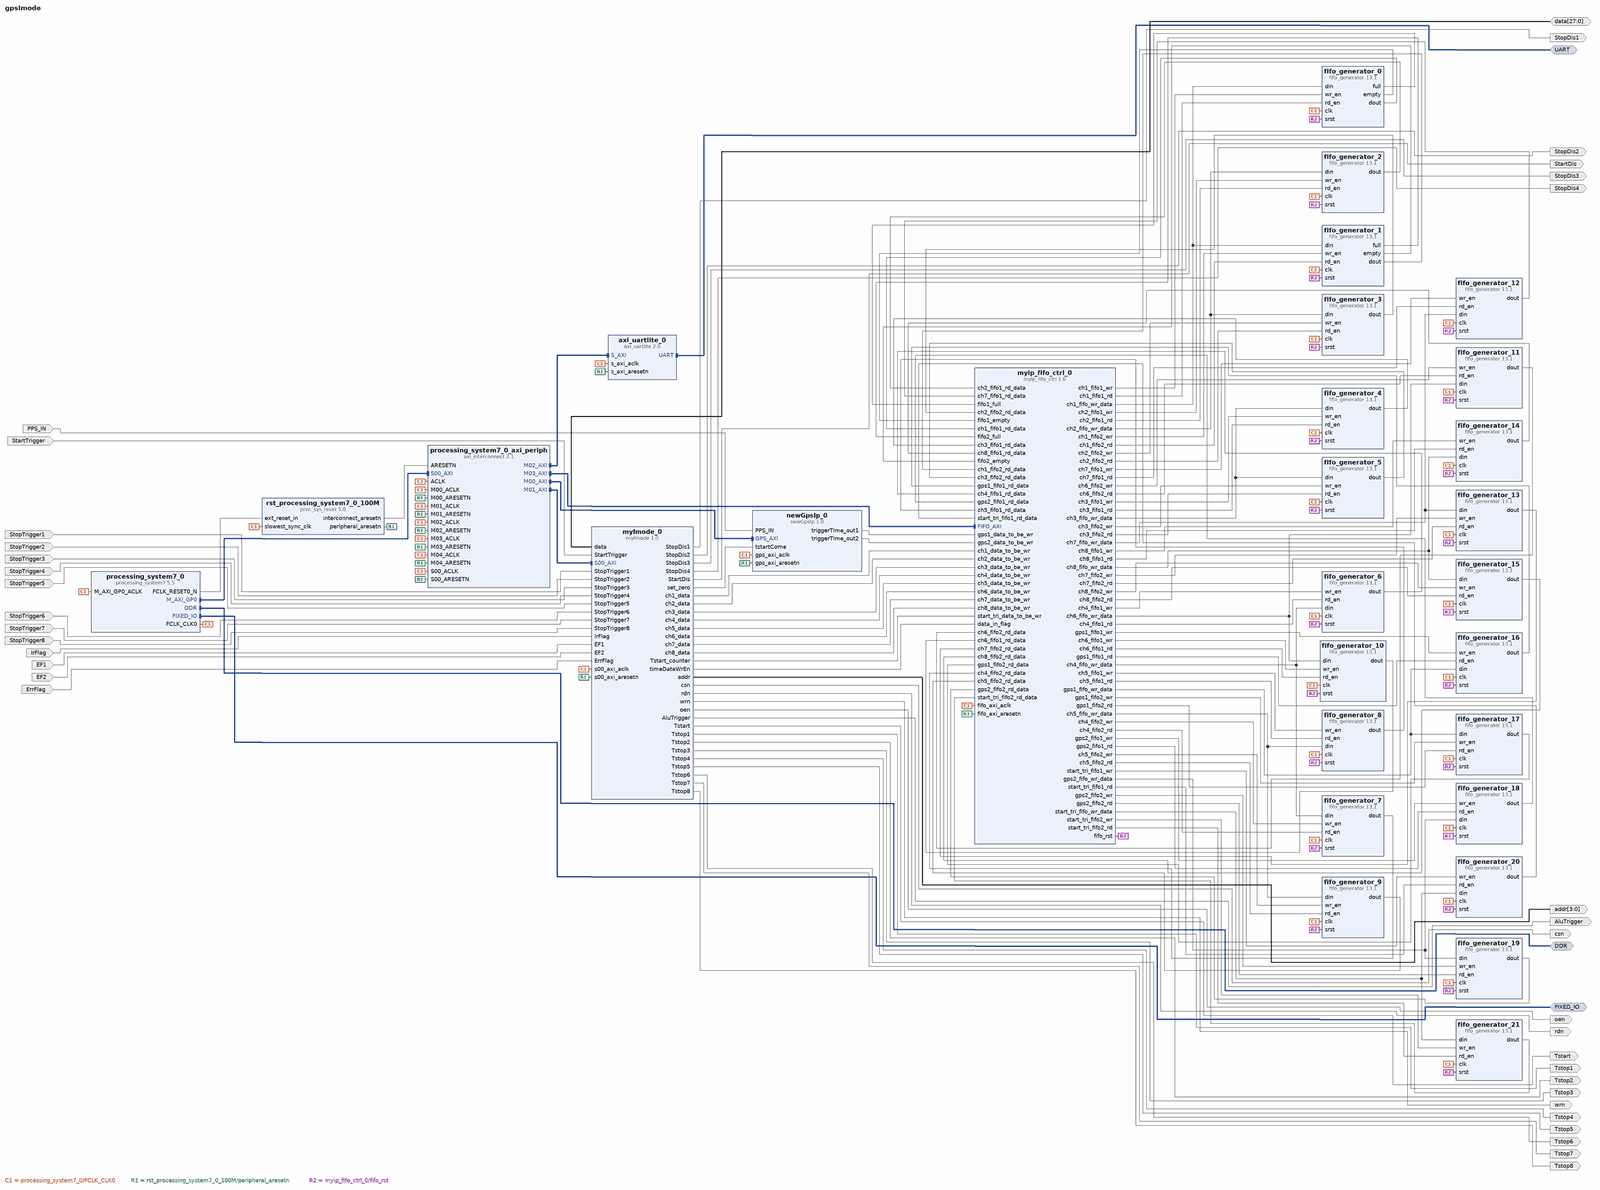
[diagram p0: block diagram of the top level, whole]
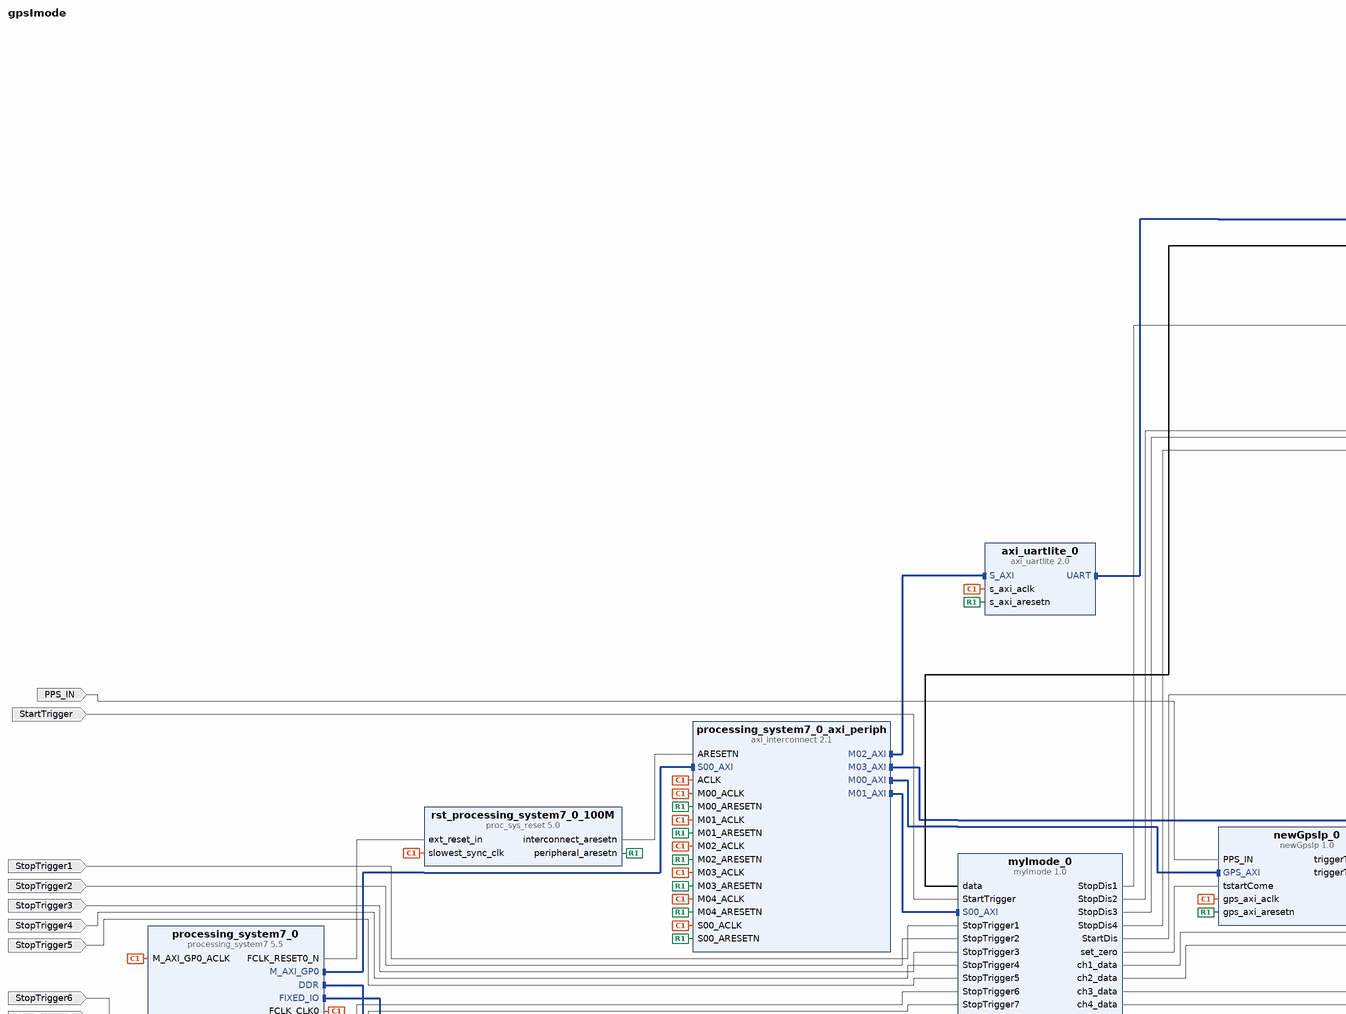
[diagram p1: block diagram of the top level, upper left part]
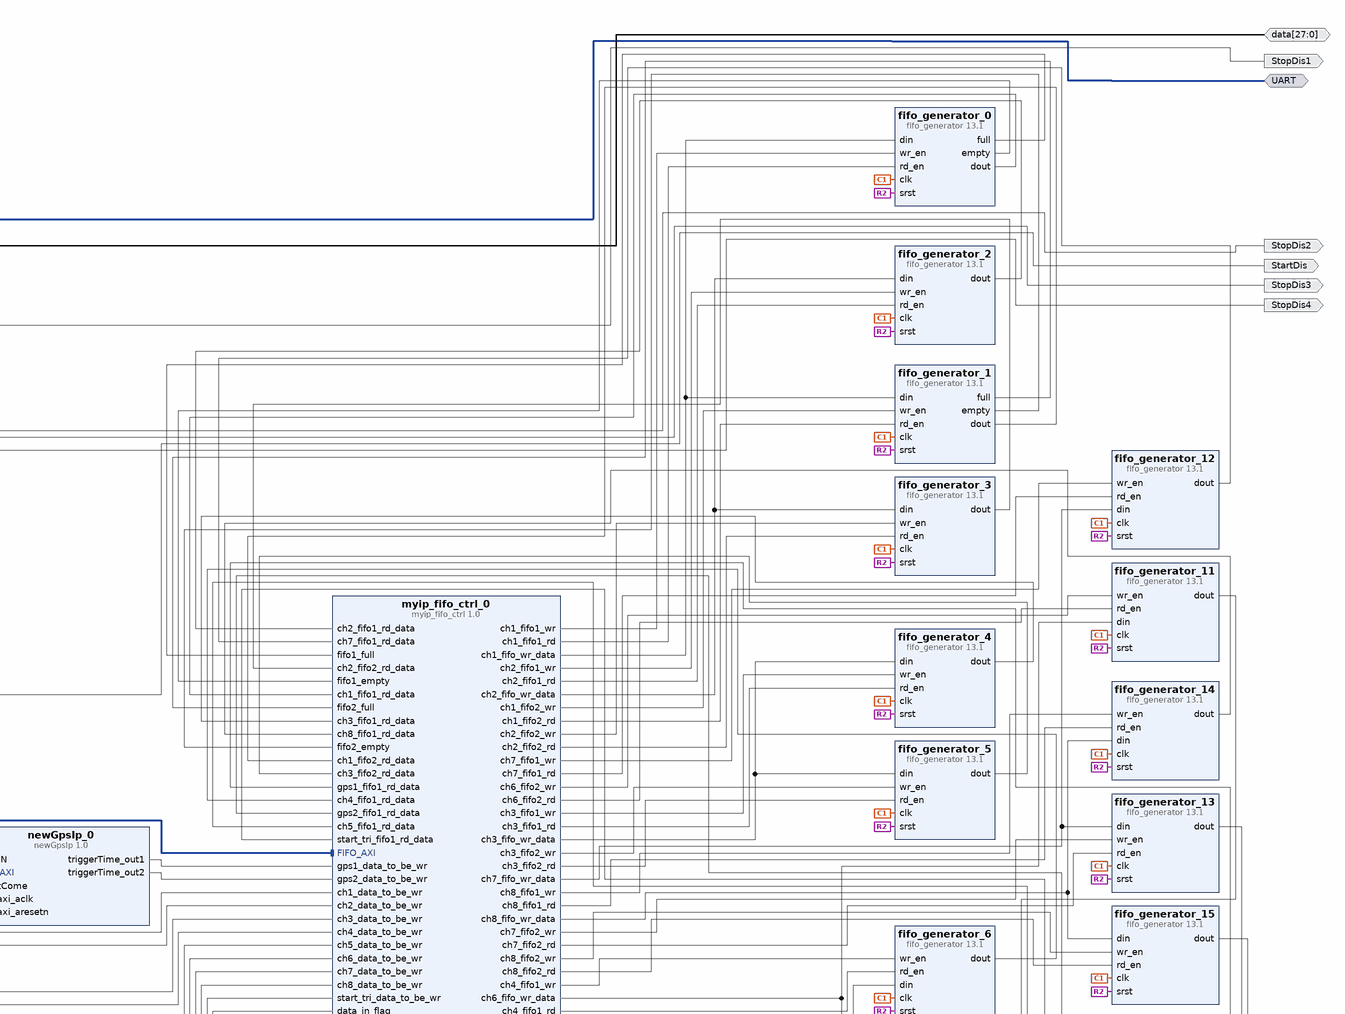
[diagram p2: block diagram of the top level, upper right part]
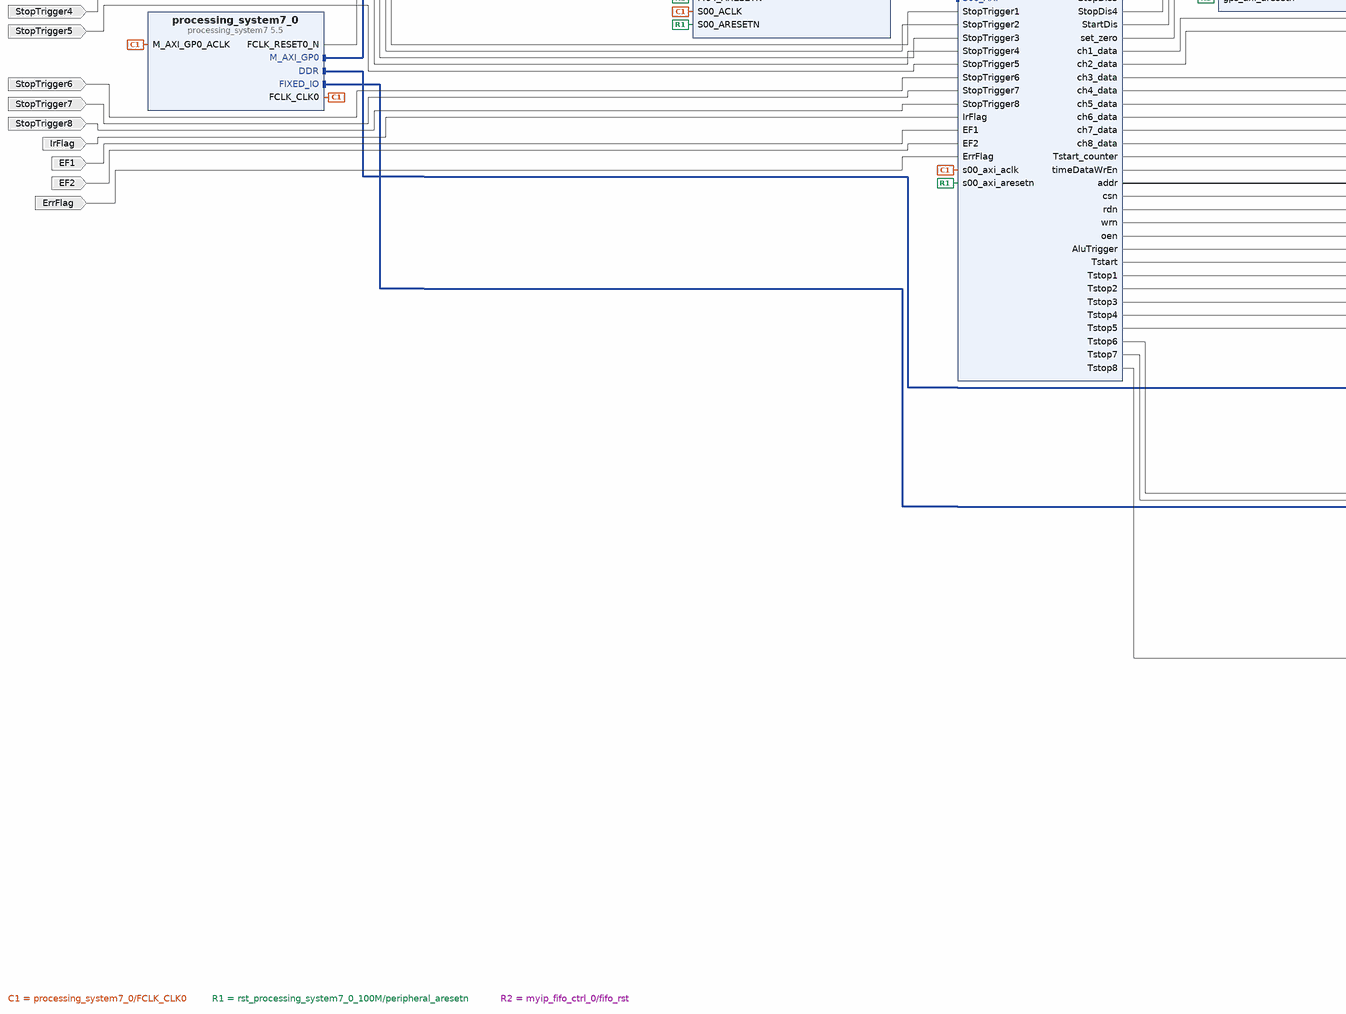
[diagram p3: block diagram of the top level, lower left part]
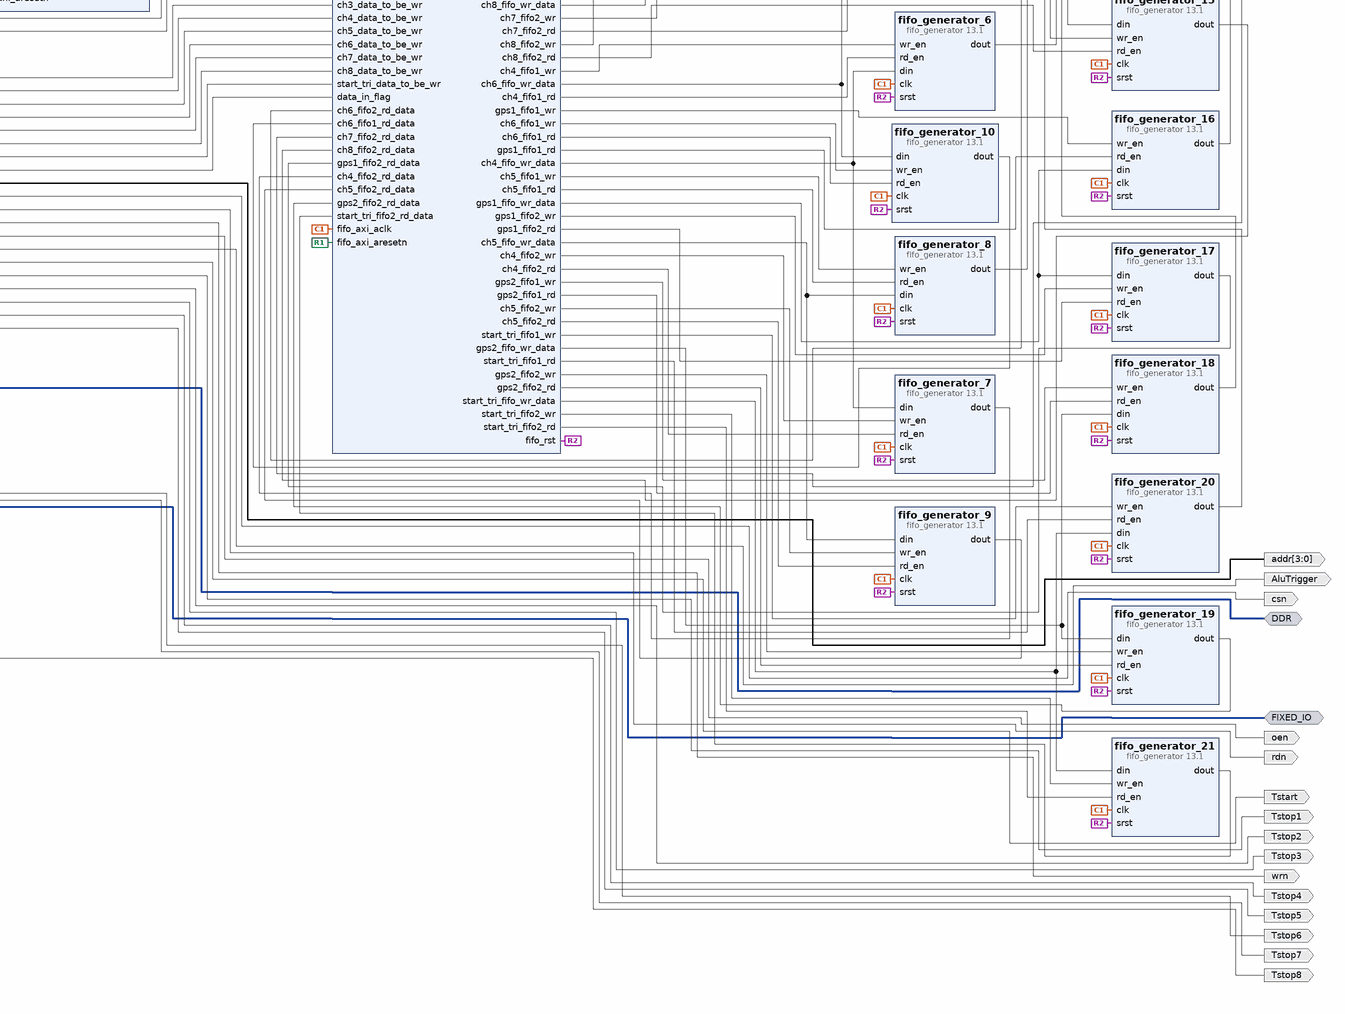
[diagram p4: block diagram of the top level, lower right part]
# Vivado block design gpsImode, Vivado 2016.2
create_bd_design gpsImode

create_bd_intf_port -mode Master -vlnv xilinx.com:interface:ddrx_rtl:1.0 DDR
create_bd_intf_port -mode Master -vlnv xilinx.com:display_processing_system7:fixedio_rtl:1.0 FIXED_IO
create_bd_intf_port -mode Master -vlnv xilinx.com:interface:uart_rtl:1.0 UART
create_bd_port -dir I PPS_IN
create_bd_port -dir I StartTrigger
create_bd_port -dir I StopTrigger1
create_bd_port -dir I StopTrigger2
create_bd_port -dir I StopTrigger3
create_bd_port -dir I StopTrigger4
create_bd_port -dir I StopTrigger5
create_bd_port -dir I StopTrigger6
create_bd_port -dir I StopTrigger7
create_bd_port -dir I StopTrigger8
create_bd_port -dir I IrFlag
create_bd_port -dir I EF1
create_bd_port -dir O StopDis1
create_bd_port -dir O StopDis2
create_bd_port -dir O StopDis3
create_bd_port -dir O StopDis4
create_bd_port -dir O StartDis
create_bd_port -dir O -from 3 -to 0 addr
create_bd_port -dir IO -from 27 -to 0 data
create_bd_port -dir O wrn
create_bd_port -dir O rdn
create_bd_port -dir O csn
create_bd_port -dir O oen
create_bd_port -dir O AluTrigger
create_bd_port -dir O Tstart
create_bd_port -dir O Tstop1
create_bd_port -dir O Tstop2
create_bd_port -dir O Tstop3
create_bd_port -dir O Tstop4
create_bd_port -dir O Tstop5
create_bd_port -dir O Tstop6
create_bd_port -dir O Tstop7
create_bd_port -dir O Tstop8
create_bd_port -dir I EF2
create_bd_port -dir I ErrFlag

create_bd_cell -type ip -vlnv xilinx.com:ip:processing_system7:5.5 processing_system7_0
set_property -dict [list \
  CONFIG.PCW_USE_FABRIC_INTERRUPT 1 \
  CONFIG.PCW_IRQ_F2P_INTR 1 \
  CONFIG.PCW_QSPI_GRP_SINGLE_SS_ENABLE 1 \
  CONFIG.preset ZedBoard \
] [get_bd_cells processing_system7_0]
create_bd_cell -type ip -vlnv xilinx.com:ip:axi_uartlite:2.0 axi_uartlite_0
create_bd_cell -type ip -vlnv xilinx.com:ip:axi_interconnect:2.1 processing_system7_0_axi_periph
set_property -dict {CONFIG.NUM_MI 5} [get_bd_cells processing_system7_0_axi_periph]
create_bd_cell -type ip -vlnv xilinx.com:ip:proc_sys_reset:5.0 rst_processing_system7_0_100M
create_bd_cell -type ip -vlnv xilinx.com:ip:fifo_generator:13.1 fifo_generator_0
set_property -dict [list \
  CONFIG.Input_Data_Width 17 \
  CONFIG.Input_Depth 8192 \
  CONFIG.Output_Data_Width 17 \
] [get_bd_cells fifo_generator_0]
create_bd_cell -type ip -vlnv xilinx.com:ip:fifo_generator:13.1 fifo_generator_1
set_property -dict [list \
  CONFIG.Input_Data_Width 17 \
  CONFIG.Input_Depth 8192 \
  CONFIG.Output_Data_Width 17 \
] [get_bd_cells fifo_generator_1]
create_bd_cell -type ip -vlnv xilinx.com:ip:fifo_generator:13.1 fifo_generator_2
set_property -dict [list \
  CONFIG.Input_Data_Width 17 \
  CONFIG.Input_Depth 8192 \
  CONFIG.Output_Data_Width 17 \
] [get_bd_cells fifo_generator_2]
create_bd_cell -type ip -vlnv xilinx.com:ip:fifo_generator:13.1 fifo_generator_3
set_property -dict [list \
  CONFIG.Input_Data_Width 17 \
  CONFIG.Input_Depth 8192 \
  CONFIG.Output_Data_Width 17 \
] [get_bd_cells fifo_generator_3]
create_bd_cell -type ip -vlnv xilinx.com:ip:fifo_generator:13.1 fifo_generator_4
set_property -dict [list \
  CONFIG.Input_Data_Width 17 \
  CONFIG.Input_Depth 8192 \
  CONFIG.Output_Data_Width 17 \
] [get_bd_cells fifo_generator_4]
create_bd_cell -type ip -vlnv xilinx.com:ip:fifo_generator:13.1 fifo_generator_5
set_property -dict [list \
  CONFIG.Input_Data_Width 17 \
  CONFIG.Input_Depth 8192 \
  CONFIG.Output_Data_Width 17 \
] [get_bd_cells fifo_generator_5]
create_bd_cell -type ip -vlnv xilinx.com:ip:fifo_generator:13.1 fifo_generator_6
set_property -dict [list \
  CONFIG.Input_Data_Width 17 \
  CONFIG.Input_Depth 8192 \
  CONFIG.Output_Data_Width 17 \
] [get_bd_cells fifo_generator_6]
create_bd_cell -type ip -vlnv xilinx.com:ip:fifo_generator:13.1 fifo_generator_7
set_property -dict [list \
  CONFIG.Input_Data_Width 17 \
  CONFIG.Input_Depth 8192 \
  CONFIG.Output_Data_Width 17 \
] [get_bd_cells fifo_generator_7]
create_bd_cell -type ip -vlnv xilinx.com:ip:fifo_generator:13.1 fifo_generator_8
set_property -dict [list \
  CONFIG.Input_Data_Width 17 \
  CONFIG.Input_Depth 8192 \
  CONFIG.Output_Data_Width 17 \
] [get_bd_cells fifo_generator_8]
create_bd_cell -type ip -vlnv xilinx.com:ip:fifo_generator:13.1 fifo_generator_9
set_property -dict [list \
  CONFIG.Input_Data_Width 17 \
  CONFIG.Input_Depth 8192 \
  CONFIG.Output_Data_Width 17 \
] [get_bd_cells fifo_generator_9]
create_bd_cell -type ip -vlnv xilinx.com:ip:fifo_generator:13.1 fifo_generator_10
set_property -dict [list \
  CONFIG.Input_Data_Width 17 \
  CONFIG.Input_Depth 8192 \
  CONFIG.Output_Data_Width 17 \
] [get_bd_cells fifo_generator_10]
create_bd_cell -type ip -vlnv xilinx.com:ip:fifo_generator:13.1 fifo_generator_11
set_property -dict [list \
  CONFIG.Input_Data_Width 17 \
  CONFIG.Input_Depth 8192 \
  CONFIG.Output_Data_Width 17 \
] [get_bd_cells fifo_generator_11]
create_bd_cell -type ip -vlnv xilinx.com:ip:fifo_generator:13.1 fifo_generator_12
set_property -dict [list \
  CONFIG.Input_Data_Width 17 \
  CONFIG.Input_Depth 8192 \
  CONFIG.Output_Data_Width 17 \
] [get_bd_cells fifo_generator_12]
create_bd_cell -type ip -vlnv xilinx.com:ip:fifo_generator:13.1 fifo_generator_13
set_property -dict [list \
  CONFIG.Input_Data_Width 17 \
  CONFIG.Input_Depth 8192 \
  CONFIG.Output_Data_Width 17 \
] [get_bd_cells fifo_generator_13]
create_bd_cell -type ip -vlnv xilinx.com:ip:fifo_generator:13.1 fifo_generator_14
set_property -dict [list \
  CONFIG.Input_Data_Width 17 \
  CONFIG.Input_Depth 8192 \
  CONFIG.Output_Data_Width 17 \
] [get_bd_cells fifo_generator_14]
create_bd_cell -type ip -vlnv xilinx.com:ip:fifo_generator:13.1 fifo_generator_15
set_property -dict [list \
  CONFIG.Input_Data_Width 17 \
  CONFIG.Input_Depth 8192 \
  CONFIG.Output_Data_Width 17 \
] [get_bd_cells fifo_generator_15]
create_bd_cell -type ip -vlnv xilinx.com:ip:fifo_generator:13.1 fifo_generator_16
set_property -dict [list \
  CONFIG.Input_Data_Width 32 \
  CONFIG.Input_Depth 8192 \
  CONFIG.Output_Data_Width 32 \
] [get_bd_cells fifo_generator_16]
create_bd_cell -type ip -vlnv xilinx.com:ip:fifo_generator:13.1 fifo_generator_17
set_property -dict [list \
  CONFIG.Input_Data_Width 32 \
  CONFIG.Input_Depth 8192 \
  CONFIG.Output_Data_Width 32 \
] [get_bd_cells fifo_generator_17]
create_bd_cell -type ip -vlnv xilinx.com:ip:fifo_generator:13.1 fifo_generator_18
set_property -dict [list \
  CONFIG.Input_Data_Width 32 \
  CONFIG.Input_Depth 8192 \
  CONFIG.Output_Data_Width 32 \
] [get_bd_cells fifo_generator_18]
create_bd_cell -type ip -vlnv xilinx.com:ip:fifo_generator:13.1 fifo_generator_19
set_property -dict [list \
  CONFIG.Input_Data_Width 32 \
  CONFIG.Input_Depth 8192 \
  CONFIG.Output_Data_Width 32 \
] [get_bd_cells fifo_generator_19]
create_bd_cell -type ip -vlnv xilinx.com:ip:fifo_generator:13.1 fifo_generator_20
set_property -dict [list \
  CONFIG.Input_Data_Width 32 \
  CONFIG.Input_Depth 8192 \
  CONFIG.Output_Data_Width 32 \
] [get_bd_cells fifo_generator_20]
create_bd_cell -type ip -vlnv xilinx.com:ip:fifo_generator:13.1 fifo_generator_21
set_property -dict [list \
  CONFIG.Input_Data_Width 32 \
  CONFIG.Input_Depth 8192 \
  CONFIG.Output_Data_Width 32 \
] [get_bd_cells fifo_generator_21]
create_bd_cell -type ip -vlnv xilinx.com:user:myip_fifo_ctrl:1.0 myip_fifo_ctrl_0
create_bd_cell -type ip -vlnv xilinx.com:user:myImode:1.0 myImode_0
create_bd_cell -type ip -vlnv xilinx.com:user:newGpsIp:1.0 newGpsIp_0

# ---- connections ----

connect_bd_intf_net [get_bd_intf_pins processing_system7_0/M_AXI_GP0] [get_bd_intf_pins processing_system7_0_axi_periph/S00_AXI]
connect_bd_intf_net [get_bd_intf_pins processing_system7_0_axi_periph/M00_AXI] [get_bd_intf_pins newGpsIp_0/GPS_AXI]
connect_bd_intf_net [get_bd_intf_pins processing_system7_0_axi_periph/M02_AXI] [get_bd_intf_pins axi_uartlite_0/S_AXI]
connect_bd_intf_net [get_bd_intf_pins processing_system7_0_axi_periph/M01_AXI] [get_bd_intf_pins myImode_0/S00_AXI]
connect_bd_intf_net [get_bd_intf_pins processing_system7_0_axi_periph/M03_AXI] [get_bd_intf_pins myip_fifo_ctrl_0/FIFO_AXI]
connect_bd_intf_net [get_bd_intf_ports DDR] [get_bd_intf_pins processing_system7_0/DDR]
connect_bd_intf_net [get_bd_intf_ports FIXED_IO] [get_bd_intf_pins processing_system7_0/FIXED_IO]
connect_bd_intf_net [get_bd_intf_ports UART] [get_bd_intf_pins axi_uartlite_0/UART]
connect_bd_net [get_bd_ports PPS_IN] [get_bd_pins newGpsIp_0/PPS_IN]
connect_bd_net [get_bd_pins processing_system7_0/FCLK_CLK0] \
  [get_bd_pins processing_system7_0/M_AXI_GP0_ACLK] [get_bd_pins rst_processing_system7_0_100M/slowest_sync_clk] \
  [get_bd_pins axi_uartlite_0/s_axi_aclk] [get_bd_pins fifo_generator_0/clk] [get_bd_pins fifo_generator_2/clk] \
  [get_bd_pins fifo_generator_4/clk] [get_bd_pins fifo_generator_6/clk] [get_bd_pins fifo_generator_8/clk] \
  [get_bd_pins fifo_generator_10/clk] [get_bd_pins fifo_generator_12/clk] [get_bd_pins fifo_generator_14/clk] \
  [get_bd_pins fifo_generator_18/clk] [get_bd_pins fifo_generator_20/clk] [get_bd_pins fifo_generator_1/clk] \
  [get_bd_pins fifo_generator_3/clk] [get_bd_pins fifo_generator_5/clk] [get_bd_pins fifo_generator_7/clk] \
  [get_bd_pins fifo_generator_9/clk] [get_bd_pins fifo_generator_11/clk] [get_bd_pins fifo_generator_13/clk] \
  [get_bd_pins fifo_generator_15/clk] [get_bd_pins fifo_generator_17/clk] [get_bd_pins fifo_generator_19/clk] \
  [get_bd_pins fifo_generator_21/clk] [get_bd_pins fifo_generator_16/clk] [get_bd_pins myip_fifo_ctrl_0/fifo_axi_aclk] \
  [get_bd_pins processing_system7_0_axi_periph/S00_ACLK] [get_bd_pins processing_system7_0_axi_periph/ACLK] \
  [get_bd_pins processing_system7_0_axi_periph/M00_ACLK] [get_bd_pins processing_system7_0_axi_periph/M01_ACLK] \
  [get_bd_pins processing_system7_0_axi_periph/M02_ACLK] [get_bd_pins processing_system7_0_axi_periph/M03_ACLK] \
  [get_bd_pins processing_system7_0_axi_periph/M04_ACLK] [get_bd_pins myImode_0/s00_axi_aclk] \
  [get_bd_pins newGpsIp_0/gps_axi_aclk]
connect_bd_net [get_bd_pins processing_system7_0/FCLK_RESET0_N] [get_bd_pins rst_processing_system7_0_100M/ext_reset_in]
connect_bd_net [get_bd_pins rst_processing_system7_0_100M/peripheral_aresetn] \
  [get_bd_pins axi_uartlite_0/s_axi_aresetn] [get_bd_pins myip_fifo_ctrl_0/fifo_axi_aresetn] \
  [get_bd_pins processing_system7_0_axi_periph/S00_ARESETN] [get_bd_pins processing_system7_0_axi_periph/M00_ARESETN] \
  [get_bd_pins processing_system7_0_axi_periph/M01_ARESETN] [get_bd_pins processing_system7_0_axi_periph/M02_ARESETN] \
  [get_bd_pins processing_system7_0_axi_periph/M03_ARESETN] [get_bd_pins processing_system7_0_axi_periph/M04_ARESETN] \
  [get_bd_pins myImode_0/s00_axi_aresetn] [get_bd_pins newGpsIp_0/gps_axi_aresetn]
connect_bd_net [get_bd_pins rst_processing_system7_0_100M/interconnect_aresetn] [get_bd_pins processing_system7_0_axi_periph/ARESETN]
connect_bd_net [get_bd_ports StartTrigger] [get_bd_pins myImode_0/StartTrigger]
connect_bd_net -net StopTrigger1_1 [get_bd_ports StopTrigger1] [get_bd_pins myImode_0/StopTrigger1]
connect_bd_net -net StopTrigger2_1 [get_bd_ports StopTrigger2] [get_bd_pins myImode_0/StopTrigger2]
connect_bd_net -net StopTrigger3_1 [get_bd_ports StopTrigger3] [get_bd_pins myImode_0/StopTrigger3]
connect_bd_net -net StopTrigger4_1 [get_bd_ports StopTrigger4] [get_bd_pins myImode_0/StopTrigger4]
connect_bd_net -net StopTrigger5_1 [get_bd_ports StopTrigger5] [get_bd_pins myImode_0/StopTrigger5]
connect_bd_net -net StopTrigger6_1 [get_bd_ports StopTrigger6] [get_bd_pins myImode_0/StopTrigger6]
connect_bd_net -net StopTrigger7_1 [get_bd_ports StopTrigger7] [get_bd_pins myImode_0/StopTrigger7]
connect_bd_net -net StopTrigger8_1 [get_bd_ports StopTrigger8] [get_bd_pins myImode_0/StopTrigger8]
connect_bd_net [get_bd_ports IrFlag] [get_bd_pins myImode_0/IrFlag]
connect_bd_net -net EF1_1 [get_bd_ports EF1] [get_bd_pins myImode_0/EF1]
connect_bd_net [get_bd_pins myImode_0/StopDis1] [get_bd_ports StopDis1]
connect_bd_net [get_bd_pins myImode_0/StopDis2] [get_bd_ports StopDis2]
connect_bd_net [get_bd_pins myImode_0/StopDis3] [get_bd_ports StopDis3]
connect_bd_net [get_bd_pins myImode_0/StopDis4] [get_bd_ports StopDis4]
connect_bd_net [get_bd_pins myImode_0/StartDis] [get_bd_ports StartDis]
connect_bd_net [get_bd_pins myImode_0/addr] [get_bd_ports addr]
connect_bd_net [get_bd_ports data] [get_bd_pins myImode_0/data]
connect_bd_net [get_bd_pins myImode_0/wrn] [get_bd_ports wrn]
connect_bd_net [get_bd_pins myImode_0/rdn] [get_bd_ports rdn]
connect_bd_net [get_bd_pins myImode_0/csn] [get_bd_ports csn]
connect_bd_net [get_bd_pins myImode_0/oen] [get_bd_ports oen]
connect_bd_net [get_bd_pins myImode_0/AluTrigger] [get_bd_ports AluTrigger]
connect_bd_net [get_bd_pins myImode_0/Tstart] [get_bd_ports Tstart]
connect_bd_net [get_bd_pins myImode_0/Tstop1] [get_bd_ports Tstop1]
connect_bd_net [get_bd_pins myImode_0/Tstop2] [get_bd_ports Tstop2]
connect_bd_net [get_bd_pins myImode_0/Tstop3] [get_bd_ports Tstop3]
connect_bd_net [get_bd_pins myImode_0/Tstop4] [get_bd_ports Tstop4]
connect_bd_net [get_bd_pins myImode_0/Tstop5] [get_bd_ports Tstop5]
connect_bd_net [get_bd_pins myImode_0/Tstop6] [get_bd_ports Tstop6]
connect_bd_net [get_bd_pins myImode_0/Tstop7] [get_bd_ports Tstop7]
connect_bd_net [get_bd_pins myImode_0/Tstop8] [get_bd_ports Tstop8]
connect_bd_net [get_bd_pins myImode_0/set_zero] [get_bd_pins newGpsIp_0/tstartCome]
connect_bd_net -net EF2_1 [get_bd_ports EF2] [get_bd_pins myImode_0/EF2]
connect_bd_net [get_bd_ports ErrFlag] [get_bd_pins myImode_0/ErrFlag]
connect_bd_net [get_bd_pins myip_fifo_ctrl_0/ch1_fifo_wr_data] [get_bd_pins fifo_generator_0/din] [get_bd_pins fifo_generator_1/din]
connect_bd_net [get_bd_pins myip_fifo_ctrl_0/ch2_fifo_wr_data] [get_bd_pins fifo_generator_2/din] [get_bd_pins fifo_generator_3/din]
connect_bd_net [get_bd_pins myip_fifo_ctrl_0/ch3_fifo_wr_data] [get_bd_pins fifo_generator_4/din] [get_bd_pins fifo_generator_5/din]
connect_bd_net [get_bd_pins myip_fifo_ctrl_0/ch4_fifo_wr_data] [get_bd_pins fifo_generator_6/din] [get_bd_pins fifo_generator_7/din]
connect_bd_net [get_bd_pins myip_fifo_ctrl_0/ch5_fifo_wr_data] [get_bd_pins fifo_generator_8/din] [get_bd_pins fifo_generator_9/din]
connect_bd_net [get_bd_pins myip_fifo_ctrl_0/ch6_fifo_wr_data] [get_bd_pins fifo_generator_10/din] [get_bd_pins fifo_generator_11/din]
connect_bd_net [get_bd_pins myip_fifo_ctrl_0/ch7_fifo_wr_data] [get_bd_pins fifo_generator_12/din] [get_bd_pins fifo_generator_13/din]
connect_bd_net [get_bd_pins myip_fifo_ctrl_0/ch8_fifo_wr_data] [get_bd_pins fifo_generator_14/din] [get_bd_pins fifo_generator_15/din]
connect_bd_net [get_bd_pins myip_fifo_ctrl_0/gps1_fifo_wr_data] [get_bd_pins fifo_generator_16/din] [get_bd_pins fifo_generator_17/din]
connect_bd_net [get_bd_pins myip_fifo_ctrl_0/gps2_fifo_wr_data] [get_bd_pins fifo_generator_18/din] [get_bd_pins fifo_generator_19/din]
connect_bd_net [get_bd_pins myip_fifo_ctrl_0/start_tri_fifo_wr_data] [get_bd_pins fifo_generator_20/din] [get_bd_pins fifo_generator_21/din]
connect_bd_net [get_bd_pins myip_fifo_ctrl_0/ch1_fifo1_wr] [get_bd_pins fifo_generator_0/wr_en]
connect_bd_net [get_bd_pins myip_fifo_ctrl_0/ch2_fifo1_wr] [get_bd_pins fifo_generator_2/wr_en]
connect_bd_net [get_bd_pins myip_fifo_ctrl_0/ch3_fifo1_wr] [get_bd_pins fifo_generator_4/wr_en]
connect_bd_net [get_bd_pins myip_fifo_ctrl_0/ch4_fifo1_wr] [get_bd_pins fifo_generator_6/wr_en]
connect_bd_net [get_bd_pins myip_fifo_ctrl_0/ch5_fifo1_wr] [get_bd_pins fifo_generator_8/wr_en]
connect_bd_net [get_bd_pins myip_fifo_ctrl_0/ch6_fifo1_wr] [get_bd_pins fifo_generator_10/wr_en]
connect_bd_net [get_bd_pins myip_fifo_ctrl_0/ch7_fifo1_wr] [get_bd_pins fifo_generator_12/wr_en]
connect_bd_net [get_bd_pins myip_fifo_ctrl_0/ch8_fifo1_wr] [get_bd_pins fifo_generator_14/wr_en]
connect_bd_net [get_bd_pins myip_fifo_ctrl_0/gps1_fifo1_wr] [get_bd_pins fifo_generator_16/wr_en]
connect_bd_net [get_bd_pins myip_fifo_ctrl_0/gps2_fifo1_wr] [get_bd_pins fifo_generator_18/wr_en]
connect_bd_net [get_bd_pins myip_fifo_ctrl_0/start_tri_fifo1_wr] [get_bd_pins fifo_generator_20/wr_en]
connect_bd_net [get_bd_pins myip_fifo_ctrl_0/ch1_fifo2_wr] [get_bd_pins fifo_generator_1/wr_en]
connect_bd_net [get_bd_pins myip_fifo_ctrl_0/ch2_fifo2_wr] [get_bd_pins fifo_generator_3/wr_en]
connect_bd_net [get_bd_pins myip_fifo_ctrl_0/ch3_fifo2_wr] [get_bd_pins fifo_generator_5/wr_en]
connect_bd_net [get_bd_pins myip_fifo_ctrl_0/ch4_fifo2_wr] [get_bd_pins fifo_generator_7/wr_en]
connect_bd_net [get_bd_pins myip_fifo_ctrl_0/ch5_fifo2_wr] [get_bd_pins fifo_generator_9/wr_en]
connect_bd_net [get_bd_pins myip_fifo_ctrl_0/ch6_fifo2_wr] [get_bd_pins fifo_generator_11/wr_en]
connect_bd_net [get_bd_pins myip_fifo_ctrl_0/ch7_fifo2_wr] [get_bd_pins fifo_generator_13/wr_en]
connect_bd_net [get_bd_pins myip_fifo_ctrl_0/ch8_fifo2_wr] [get_bd_pins fifo_generator_15/wr_en]
connect_bd_net [get_bd_pins myip_fifo_ctrl_0/gps1_fifo2_wr] [get_bd_pins fifo_generator_17/wr_en]
connect_bd_net [get_bd_pins myip_fifo_ctrl_0/gps2_fifo2_wr] [get_bd_pins fifo_generator_19/wr_en]
connect_bd_net [get_bd_pins myip_fifo_ctrl_0/start_tri_fifo2_wr] [get_bd_pins fifo_generator_21/wr_en]
connect_bd_net [get_bd_pins fifo_generator_0/full] [get_bd_pins myip_fifo_ctrl_0/fifo1_full]
connect_bd_net [get_bd_pins fifo_generator_1/full] [get_bd_pins myip_fifo_ctrl_0/fifo2_full]
connect_bd_net [get_bd_pins fifo_generator_0/empty] [get_bd_pins myip_fifo_ctrl_0/fifo1_empty]
connect_bd_net [get_bd_pins fifo_generator_1/empty] [get_bd_pins myip_fifo_ctrl_0/fifo2_empty]
connect_bd_net [get_bd_pins fifo_generator_0/dout] [get_bd_pins myip_fifo_ctrl_0/ch1_fifo1_rd_data]
connect_bd_net [get_bd_pins myip_fifo_ctrl_0/ch1_fifo1_rd] [get_bd_pins fifo_generator_0/rd_en]
connect_bd_net [get_bd_pins myip_fifo_ctrl_0/fifo_rst] \
  [get_bd_pins fifo_generator_0/srst] [get_bd_pins fifo_generator_2/srst] [get_bd_pins fifo_generator_4/srst] \
  [get_bd_pins fifo_generator_6/srst] [get_bd_pins fifo_generator_8/srst] [get_bd_pins fifo_generator_10/srst] \
  [get_bd_pins fifo_generator_12/srst] [get_bd_pins fifo_generator_14/srst] [get_bd_pins fifo_generator_18/srst] \
  [get_bd_pins fifo_generator_20/srst] [get_bd_pins fifo_generator_1/srst] [get_bd_pins fifo_generator_3/srst] \
  [get_bd_pins fifo_generator_5/srst] [get_bd_pins fifo_generator_7/srst] [get_bd_pins fifo_generator_9/srst] \
  [get_bd_pins fifo_generator_11/srst] [get_bd_pins fifo_generator_13/srst] [get_bd_pins fifo_generator_15/srst] \
  [get_bd_pins fifo_generator_17/srst] [get_bd_pins fifo_generator_19/srst] [get_bd_pins fifo_generator_21/srst] \
  [get_bd_pins fifo_generator_16/srst]
connect_bd_net [get_bd_pins fifo_generator_2/dout] [get_bd_pins myip_fifo_ctrl_0/ch2_fifo1_rd_data]
connect_bd_net [get_bd_pins myip_fifo_ctrl_0/ch2_fifo1_rd] [get_bd_pins fifo_generator_2/rd_en]
connect_bd_net [get_bd_pins myip_fifo_ctrl_0/ch3_fifo1_rd] [get_bd_pins fifo_generator_4/rd_en]
connect_bd_net [get_bd_pins fifo_generator_4/dout] [get_bd_pins myip_fifo_ctrl_0/ch3_fifo1_rd_data]
connect_bd_net [get_bd_pins myip_fifo_ctrl_0/ch4_fifo1_rd] [get_bd_pins fifo_generator_6/rd_en]
connect_bd_net [get_bd_pins fifo_generator_6/dout] [get_bd_pins myip_fifo_ctrl_0/ch4_fifo1_rd_data]
connect_bd_net [get_bd_pins myip_fifo_ctrl_0/ch5_fifo1_rd] [get_bd_pins fifo_generator_8/rd_en]
connect_bd_net [get_bd_pins fifo_generator_8/dout] [get_bd_pins myip_fifo_ctrl_0/ch5_fifo1_rd_data]
connect_bd_net [get_bd_pins fifo_generator_10/dout] [get_bd_pins myip_fifo_ctrl_0/ch6_fifo1_rd_data]
connect_bd_net [get_bd_pins myip_fifo_ctrl_0/ch6_fifo1_rd] [get_bd_pins fifo_generator_10/rd_en]
connect_bd_net [get_bd_pins fifo_generator_12/dout] [get_bd_pins myip_fifo_ctrl_0/ch7_fifo1_rd_data]
connect_bd_net [get_bd_pins myip_fifo_ctrl_0/ch7_fifo1_rd] [get_bd_pins fifo_generator_12/rd_en]
connect_bd_net [get_bd_pins fifo_generator_14/dout] [get_bd_pins myip_fifo_ctrl_0/ch8_fifo1_rd_data]
connect_bd_net [get_bd_pins myip_fifo_ctrl_0/ch8_fifo1_rd] [get_bd_pins fifo_generator_14/rd_en]
connect_bd_net [get_bd_pins fifo_generator_16/dout] [get_bd_pins myip_fifo_ctrl_0/gps1_fifo1_rd_data]
connect_bd_net [get_bd_pins myip_fifo_ctrl_0/gps1_fifo1_rd] [get_bd_pins fifo_generator_16/rd_en]
connect_bd_net [get_bd_pins fifo_generator_18/dout] [get_bd_pins myip_fifo_ctrl_0/gps2_fifo1_rd_data]
connect_bd_net [get_bd_pins myip_fifo_ctrl_0/gps2_fifo1_rd] [get_bd_pins fifo_generator_18/rd_en]
connect_bd_net [get_bd_pins fifo_generator_20/dout] [get_bd_pins myip_fifo_ctrl_0/start_tri_fifo1_rd_data]
connect_bd_net [get_bd_pins myip_fifo_ctrl_0/start_tri_fifo1_rd] [get_bd_pins fifo_generator_20/rd_en]
connect_bd_net [get_bd_pins fifo_generator_1/dout] [get_bd_pins myip_fifo_ctrl_0/ch1_fifo2_rd_data]
connect_bd_net [get_bd_pins myip_fifo_ctrl_0/ch1_fifo2_rd] [get_bd_pins fifo_generator_1/rd_en]
connect_bd_net [get_bd_pins fifo_generator_3/dout] [get_bd_pins myip_fifo_ctrl_0/ch2_fifo2_rd_data]
connect_bd_net [get_bd_pins myip_fifo_ctrl_0/ch2_fifo2_rd] [get_bd_pins fifo_generator_3/rd_en]
connect_bd_net [get_bd_pins fifo_generator_5/dout] [get_bd_pins myip_fifo_ctrl_0/ch3_fifo2_rd_data]
connect_bd_net [get_bd_pins myip_fifo_ctrl_0/ch3_fifo2_rd] [get_bd_pins fifo_generator_5/rd_en]
connect_bd_net [get_bd_pins fifo_generator_7/dout] [get_bd_pins myip_fifo_ctrl_0/ch4_fifo2_rd_data]
connect_bd_net [get_bd_pins myip_fifo_ctrl_0/ch4_fifo2_rd] [get_bd_pins fifo_generator_7/rd_en]
connect_bd_net [get_bd_pins fifo_generator_9/dout] [get_bd_pins myip_fifo_ctrl_0/ch5_fifo2_rd_data]
connect_bd_net [get_bd_pins myip_fifo_ctrl_0/ch5_fifo2_rd] [get_bd_pins fifo_generator_9/rd_en]
connect_bd_net [get_bd_pins fifo_generator_11/dout] [get_bd_pins myip_fifo_ctrl_0/ch6_fifo2_rd_data]
connect_bd_net [get_bd_pins myip_fifo_ctrl_0/ch6_fifo2_rd] [get_bd_pins fifo_generator_11/rd_en]
connect_bd_net [get_bd_pins fifo_generator_13/dout] [get_bd_pins myip_fifo_ctrl_0/ch7_fifo2_rd_data]
connect_bd_net [get_bd_pins myip_fifo_ctrl_0/ch7_fifo2_rd] [get_bd_pins fifo_generator_13/rd_en]
connect_bd_net [get_bd_pins fifo_generator_15/dout] [get_bd_pins myip_fifo_ctrl_0/ch8_fifo2_rd_data]
connect_bd_net [get_bd_pins myip_fifo_ctrl_0/ch8_fifo2_rd] [get_bd_pins fifo_generator_15/rd_en]
connect_bd_net [get_bd_pins fifo_generator_17/dout] [get_bd_pins myip_fifo_ctrl_0/gps1_fifo2_rd_data]
connect_bd_net [get_bd_pins myip_fifo_ctrl_0/gps1_fifo2_rd] [get_bd_pins fifo_generator_17/rd_en]
connect_bd_net [get_bd_pins fifo_generator_19/dout] [get_bd_pins myip_fifo_ctrl_0/gps2_fifo2_rd_data]
connect_bd_net [get_bd_pins myip_fifo_ctrl_0/gps2_fifo2_rd] [get_bd_pins fifo_generator_19/rd_en]
connect_bd_net [get_bd_pins fifo_generator_21/dout] [get_bd_pins myip_fifo_ctrl_0/start_tri_fifo2_rd_data]
connect_bd_net [get_bd_pins myip_fifo_ctrl_0/start_tri_fifo2_rd] [get_bd_pins fifo_generator_21/rd_en]
connect_bd_net [get_bd_pins myImode_0/ch1_data] [get_bd_pins myip_fifo_ctrl_0/ch1_data_to_be_wr]
connect_bd_net [get_bd_pins myImode_0/ch2_data] [get_bd_pins myip_fifo_ctrl_0/ch2_data_to_be_wr]
connect_bd_net [get_bd_pins myImode_0/ch3_data] [get_bd_pins myip_fifo_ctrl_0/ch3_data_to_be_wr]
connect_bd_net [get_bd_pins myImode_0/ch4_data] [get_bd_pins myip_fifo_ctrl_0/ch4_data_to_be_wr]
connect_bd_net [get_bd_pins myImode_0/ch5_data] [get_bd_pins myip_fifo_ctrl_0/ch5_data_to_be_wr]
connect_bd_net [get_bd_pins myImode_0/ch6_data] [get_bd_pins myip_fifo_ctrl_0/ch6_data_to_be_wr]
connect_bd_net [get_bd_pins myImode_0/ch7_data] [get_bd_pins myip_fifo_ctrl_0/ch7_data_to_be_wr]
connect_bd_net [get_bd_pins myImode_0/ch8_data] [get_bd_pins myip_fifo_ctrl_0/ch8_data_to_be_wr]
connect_bd_net [get_bd_pins myImode_0/Tstart_counter] [get_bd_pins myip_fifo_ctrl_0/start_tri_data_to_be_wr]
connect_bd_net [get_bd_pins newGpsIp_0/triggerTime_out1] [get_bd_pins myip_fifo_ctrl_0/gps1_data_to_be_wr]
connect_bd_net [get_bd_pins newGpsIp_0/triggerTime_out2] [get_bd_pins myip_fifo_ctrl_0/gps2_data_to_be_wr]
connect_bd_net [get_bd_pins myImode_0/timeDataWrEn] [get_bd_pins myip_fifo_ctrl_0/data_in_flag]

# ---- address map ----
assign_bd_address -offset 0x42C00000 -range 64K -target_address_space [get_bd_addr_spaces processing_system7_0/Data] [get_bd_addr_segs axi_uartlite_0/S_AXI/Reg]
assign_bd_address -offset 0x43C00000 -range 64K -target_address_space [get_bd_addr_spaces processing_system7_0/Data] [get_bd_addr_segs newGpsIp_0/GPS_AXI/GPS_AXI_reg]
assign_bd_address -offset 0x43C10000 -range 64K -target_address_space [get_bd_addr_spaces processing_system7_0/Data] [get_bd_addr_segs myImode_0/S00_AXI/S00_AXI_reg]
assign_bd_address -offset 0x43C20000 -range 64K -target_address_space [get_bd_addr_spaces processing_system7_0/Data] [get_bd_addr_segs myip_fifo_ctrl_0/FIFO_AXI/FIFO_AXI_reg]

validate_bd_design
save_bd_design
